# EAGLE design hexa170_heatedbed (EAGLE 6.4)
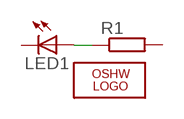
[diagram p0: schematic, sheet 1]

## Parts
LED1  LEDCHIPLED_0805  [CHIPLED_0805]
LOGO1  OSHW_LOGO_10MILX0350-NT  [OSHW_10X350_NOTEXT]
R1  R-EU_M0805  [M0805]

## Nets
N$1: LED1.A R1.1
Unconnected: LED1.C R1.2

## Library data of the parts
LED1 = adafruit_-16081a8:LED: LED OSRAM: - CHIPLED LG R971, LG N971, LY N971, LG Q971, LY Q971, LO R971, LY R971 LH N974, LH R974 LS Q976, LO Q976, LY Q976 LO Q996 - Hyper CHIPLED LW Q18S LB Q993, LB Q99A, LB R99A - SideLED LS A670, LO A670, LY A670, LG A670, LP A670 LB A673, LV A673, LT A673, LW A673 LH A674 LY A675 LS A676, LA A676, LO A676, LY A676, LW A676 LS A679, LY A679, LG A679 - Hyper Micro SIDELED® LS Y876, LA Y876, LO Y876, LY Y876 LT Y87S - SmartLED LW L88C, LW L88S LB L89C, LB L89S, LG L890 LS L89K, LO L89K, LY L89K LS L896, LA L896, LO L896, LY L896 - TOPLED LS T670, LO T670, LY T670, LG T670, LP T670 LSG T670, LSP T670, LSY T670, LOP T670, LYG T670 LG T671, LOG T671, LSG T671 LB T673, LV T673, LT T673, LW T673 LH T674 LS T676, LA T676, LO T676, LY T676, LB T676, LH T676, LSB T676, LW T676 LB T67C, LV T67C, LT T67C, LS T67K, LO T67K, LY T67K, LW E67C LS E67B, LA E67B, LO E67B, LY E67B, LB E67C, LV E67C, LT E67C LW T67C LS T679, LY T679, LG T679 LS T770, LO T770, LY T770, LG T770, LP T770 LB T773, LV T773, LT T773, LW T773 LH T774 LS E675, LA E675, LY E675, LS T675 LS T776, LA T776, LO T776, LY T776, LB T776 LHGB T686 LT T68C, LB T68C - Hyper Mini TOPLED® LB M676 - Mini TOPLED Santana® LG M470 LS M47K, LO M47K, LY M47K Source: http://www.osram.convergy.de/
LOGO1 = ohw-logo:OSHW_LOGO_10MIL
R1 = rcl_mod:R-EU_: RESISTOR, European symbol

## Board
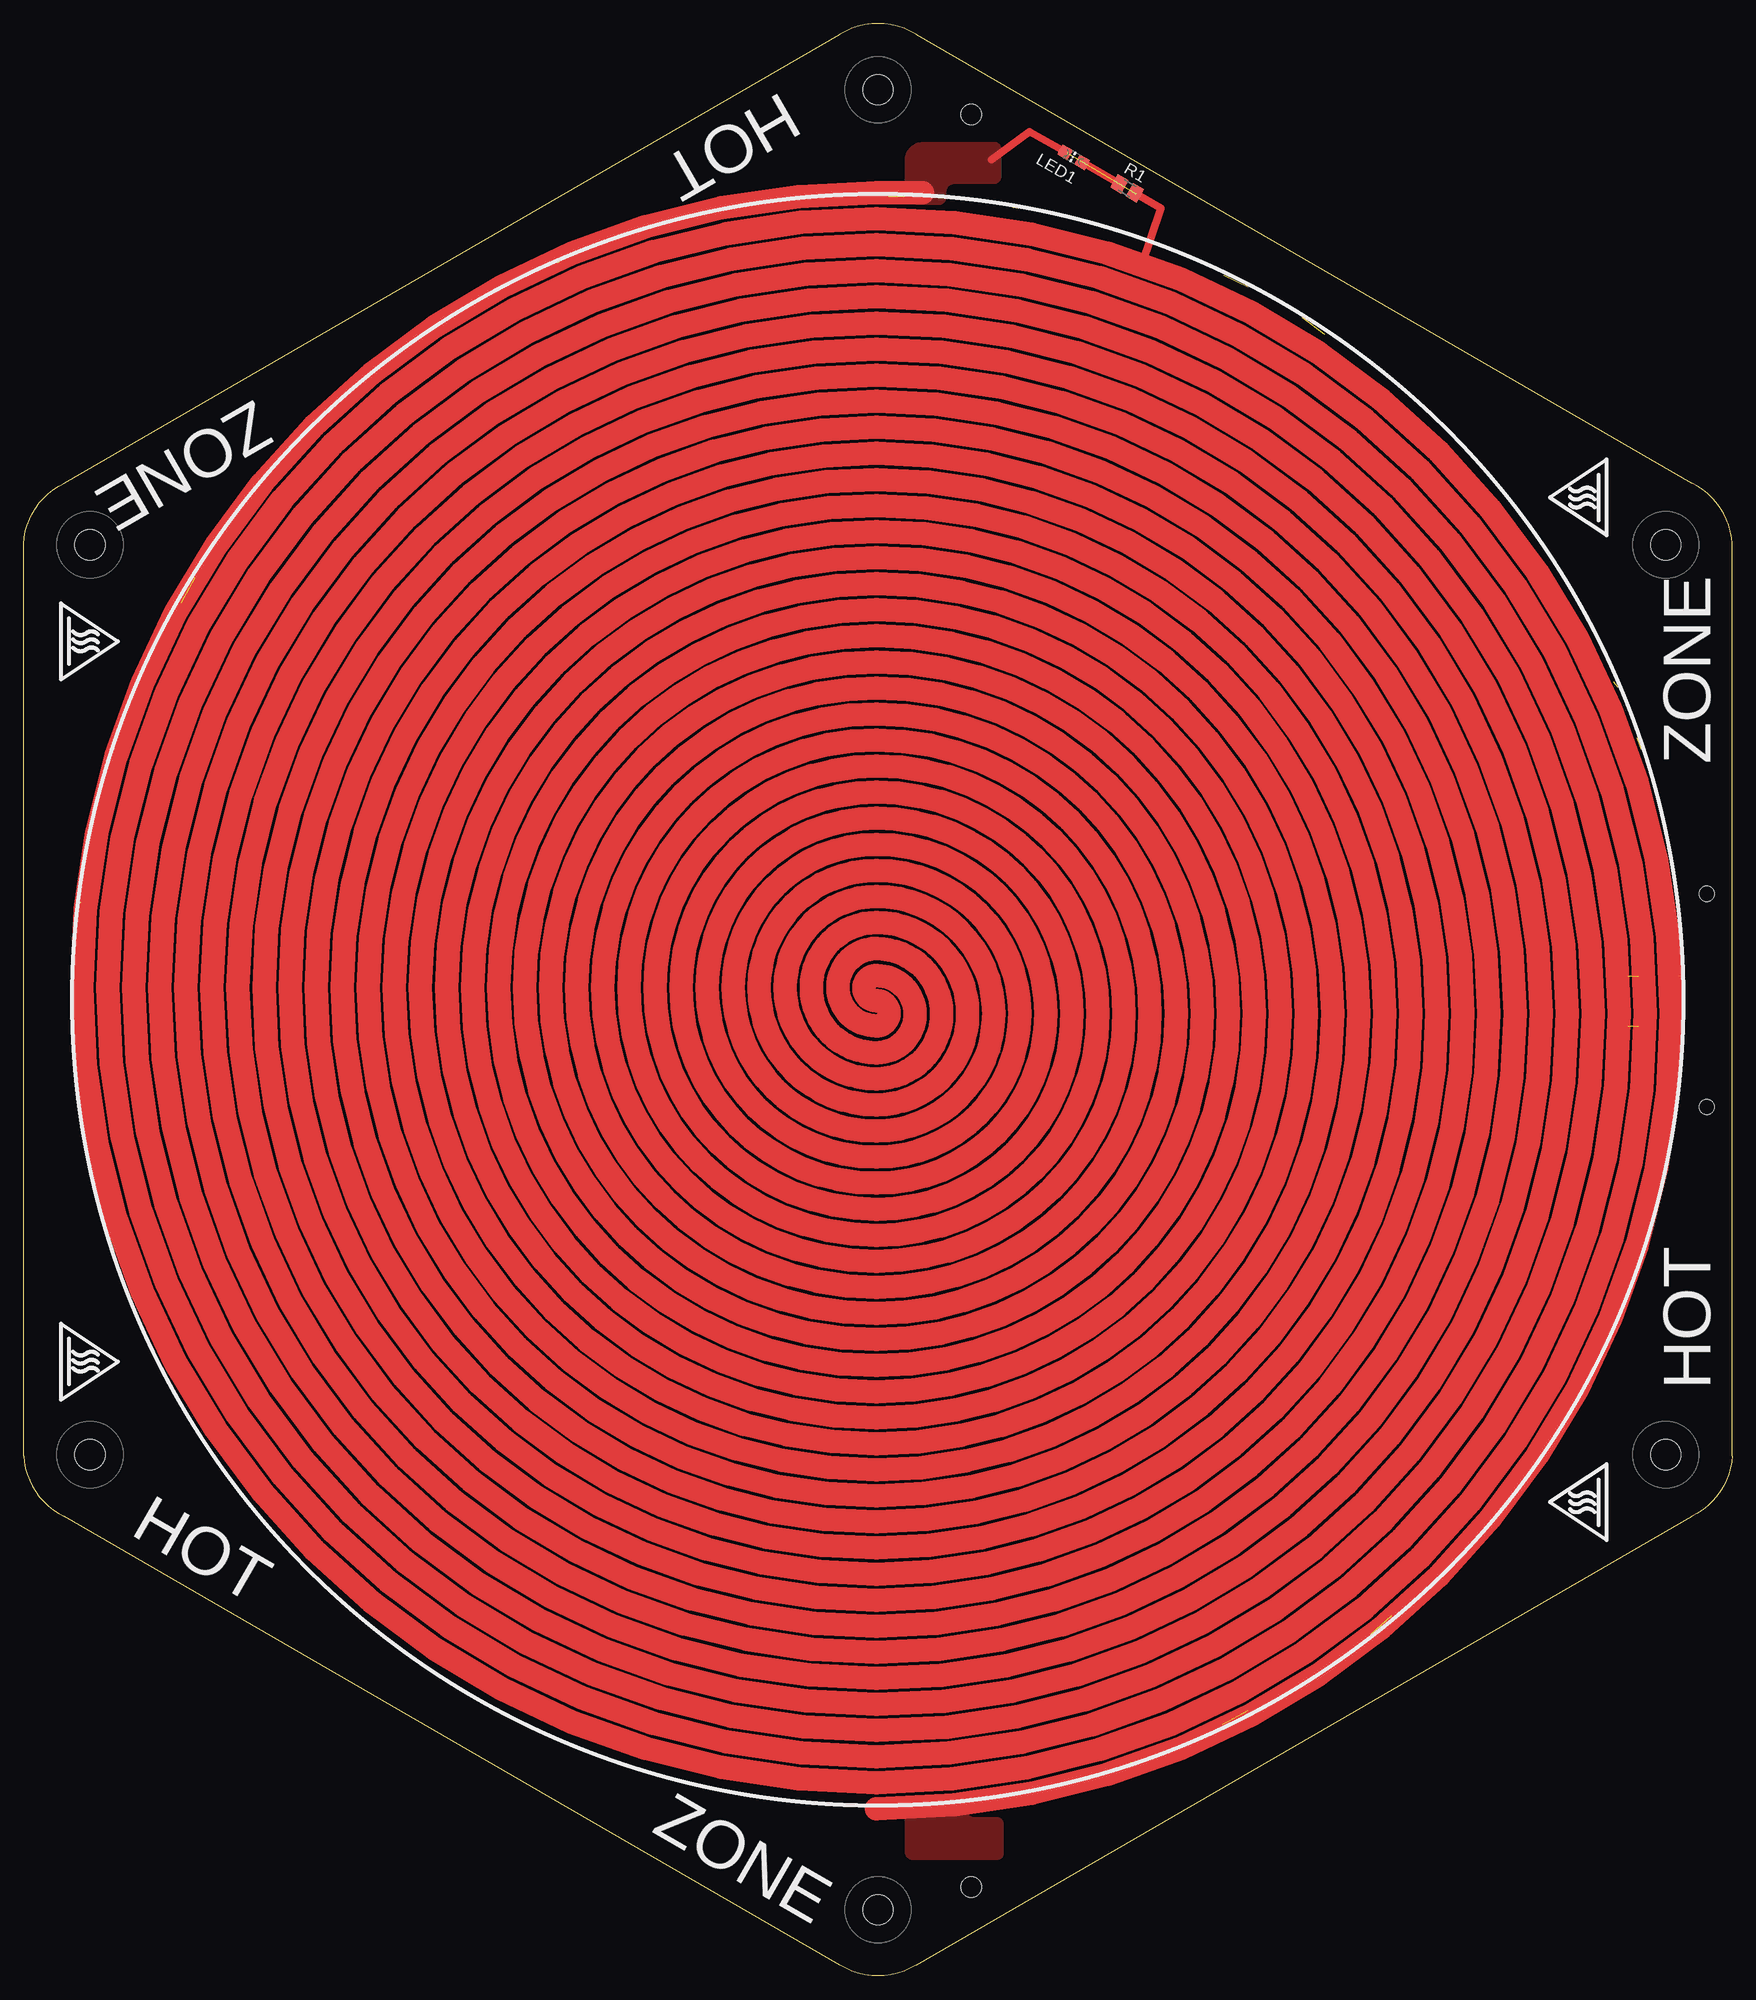
[diagram p1: board, top side]
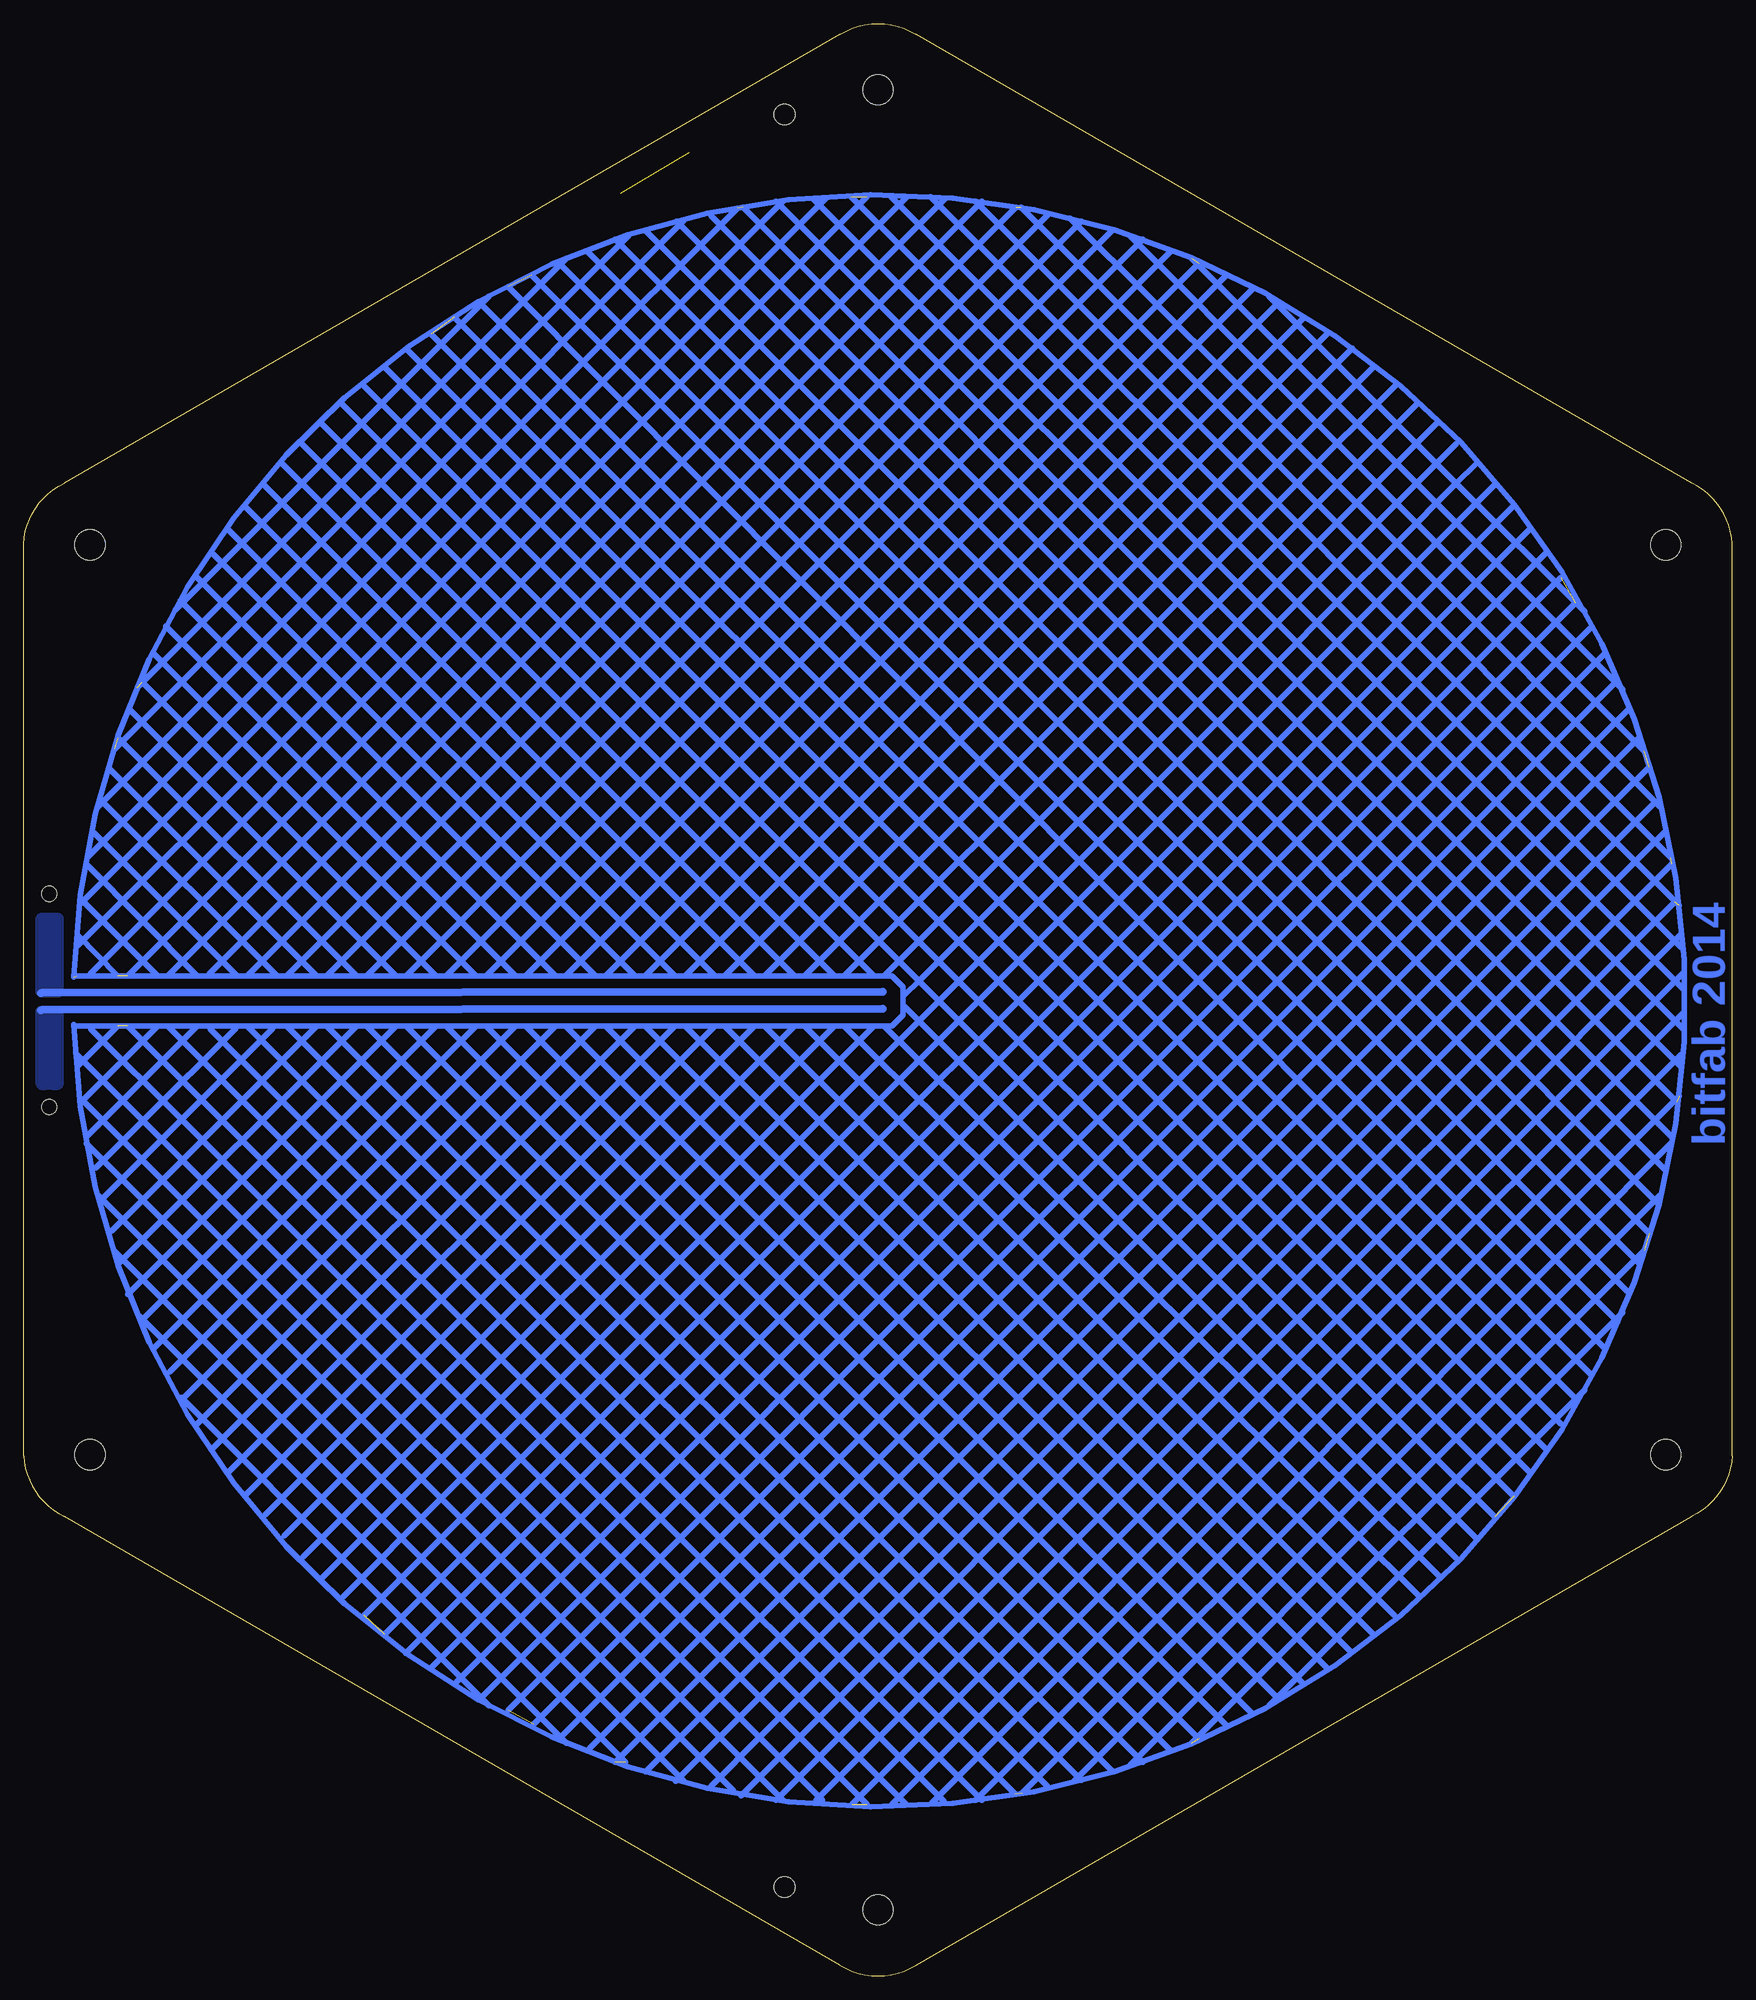
[diagram p2: board, bottom side, seen from below]

Size 180.25 x 205.95 mm. Coordinates in mm from the lower left corner, seen from the top.
Outline: 180.25,54.88 180.25,151.08 arc62 175.97,157.48 94.12,204.85 arc62 86.12,204.85 4.28,157.48 arc62 0,151.08 0,54.88 arc62 4.28,48.48 86.12,1.1 arc62 94.12,1.1 175.97,48.48 arc62 180.25,54.88
Copper layers (1*16): Top 0.035mm / dielectric 1.5mm / Bottom 0.035mm
Design rules "default": minimum track width 10mil, minimum drill 24mil, track to track 8mil, track to pad 8mil, pad to pad 8mil, via to via 8mil, smd to smd 8mil, copper to edge 40mil, drill to drill 8mil, minimum pad ring 10mil, minimum via ring 8mil, stop-mask expansion 4mil, vias tented up to drill 0mil, thermal gap 10mil
Holes 3.2 mm at 90.12,6.98 90.12,198.98 7,54.98 173.25,54.98 7,150.98 173.25,150.98
Holes 1.6 mm at 177.57,91.66 177.57,114.16
Holes 2.2 mm at 99.97,9.38 99.97,196.38

### Footprints (pad centres in the part's own frame; a part is rotated, then mirrored left to right if it is on the bottom)
CHIPLED_0805 = smd 1.2 x 1.2: A 0,-1.05; C 0,1.05
M0805 = smd 1.3 x 1.6: 1 -0.95,0; 2 0.95,0

### Placement (x,y rotation side)
LED1  110.78,191.85 60 top
LOGO1  178.97,61.28 90 top
R1  116.42,188.58 330 top

### Tracks (layer width: path | path; a pad name or v marks a point on that pad's centre or on a via)
CCW  (1 unrouted)
  Top 0.254: 90.35,188.13 89.97,189.24 89.97,188.13
  Top 0.813: 110.05,192.33 106.12,194.58 102.12,191.58 | 117.35,188.03 120,186.5 117.92,180.4
  Top 2.5: 89.97,188.13 arc180 89.97,20.38 arc180 89.97,182.63 arc180 89.97,25.88 arc180 89.97,177.13 arc180 89.97,31.38 arc180 89.97,171.63 arc180 89.97,36.88 arc180 89.97,166.13 arc180 89.97,42.38 arc180 89.97,160.63 arc180 89.97,47.88 arc180 89.97,155.13 arc180 89.97,53.38 arc180 89.97,149.63 arc180 89.97,58.88 arc180 89.97,144.13 arc180 89.97,64.38 arc180 89.97,138.63 arc180 89.97,69.88 arc180 89.97,133.13 arc180 89.97,75.38 arc180 89.97,127.63 arc180 89.97,80.88 arc180 89.97,122.13 arc180 89.97,86.38 arc180 89.97,116.63 arc180 89.97,91.88 arc180 89.97,111.13 arc180 89.97,97.38 arc180 89.97,105.53 arc180 89.97,102.88 arc-180 89.97,100.23 arc-180 89.97,108.38 arc-180 89.97,94.63 arc-180 89.97,113.88 arc-180 89.97,89.13 arc-180 89.97,119.38 arc-180 89.97,83.63 arc-180 89.97,124.88 arc-180 89.97,78.13 arc-180 89.97,130.38 arc-180 89.97,72.63 arc-180 89.97,135.88 arc-180 89.97,67.13 arc-180 89.97,141.38 arc-180 89.97,61.63 arc-180 89.97,146.88 arc-180 89.97,56.13 arc-180 89.97,152.38 arc-180 89.97,50.63 arc-180 89.97,157.88 arc-180 89.97,45.13 arc-180 89.97,163.38 arc-180 89.97,39.63 arc-180 89.97,168.88 arc-180 89.97,34.13 arc-180 89.97,174.38 arc-180 89.97,28.63 arc-180 89.97,179.88 arc-180 89.97,23.13 arc-180 89.97,185.38 arc-180 89.97,17.63 | 90.35,188.13 94.85,188.13
  pour Top: 93.77,12.23 102.67,12.23 arc90 103.38,12.93 103.38,16.03 arc90 102.67,16.73 100.3,16.73 arc-90 99.15,18.23 93.11,18.25 arc90 92.97,17.9 92.97,13.13 arc90
  pour Top: 97.3,187.45 97.33,188.2 arc-90 98.28,189.05 102.42,189.05 arc90 103.12,189.85 103.12,192.75 arc90 102.42,193.45 95.02,193.45 arc90 92.97,191.7 92.97,188.15 arc90 94.56,186.86 96.42,186.86 arc90
N$1
  Top 0.813: R1.1 LED1.A
S$1  (24 unrouted)
  Bottom 0.254: 144.56,163.81 144.59,163.84 144.63,163.79 | 54.47,73.62 54.41,73.67 54.26,73.51 | 138.25,157.51 138.24,157.49 138.28,157.44 | 35.35,54.61 35.37,54.62 35.41,54.57 | 131.95,151.21 131.88,151.14 131.94,151.09 | 41.66,60.91 41.72,60.97 41.77,60.92 | 47.95,67.21 48.06,67.32 48.12,67.27 | 138.38,128.13 138.24,128.28 138.16,128.2 | 121.65,144.71 121.72,144.79 121.58,144.93 | 163.71,90.25 163.63,90.18 163.53,90.28 | 127.97,54.72 128.07,54.62 127.91,54.45 | 32.87,44.5 32.83,44.46 33.02,44.26 | 86.02,54.77 86.17,54.62 85.95,54.41 | 79.64,157.32 79.81,157.49 79.67,157.63 | 86,96.36 86.17,96.53 85.96,96.74 | 79.67,103.02 79.81,102.88 79.65,102.71 | 140.57,42.12 140.78,41.92 140.61,41.75 | 31.35,54.41 31.55,54.62 31.41,54.76 | 31.37,151.32 31.55,151.14 31.39,150.97 | 35.55,58.61 35.37,58.43 35.22,58.57 | 134.27,48.42 134.43,48.27 134.26,48.1 | 140.6,150.96 140.78,151.14 140.58,151.33 | 45.73,157.28 45.52,157.49 45.7,157.66 | 121.67,61.02 121.72,60.97 121.56,60.8 | 134.3,144.66 134.43,144.79 134.23,144.98 | 41.85,64.91 41.72,64.78 41.57,64.92 | 41.87,140.82 41.72,140.98 41.55,140.81 | 58.31,61.05 58.23,60.97 58.42,60.77 | 58.33,144.68 58.23,144.79 58.4,144.96 | 54.45,77.51 54.41,77.48 54.27,77.62 | 54.47,128.22 54.41,128.28 54.25,128.11 | 54.3,60.86 54.41,60.97 54.25,61.13 | 60.75,83.81 60.77,83.83 60.62,83.97 | 60.77,121.92 60.77,121.93 60.6,121.76 | 71.11,77.66 70.92,77.48 70.83,77.57 | 67.05,90.11 67.11,90.18 66.97,90.32 | 66.96,115.73 67.11,115.58 66.95,115.41 | 71.06,90.31 70.92,90.18 70.97,90.13 | 77.42,121.78 77.28,121.93 77.25,121.91 | 73.35,96.41 73.47,96.53 73.32,96.67 | 73.37,109.32 73.47,109.23 73.3,109.06
  Bottom 0.254: 83.7,90.26 83.62,90.18 83.58,90.22 | 83.72,115.48 83.62,115.58 83.61,115.56 | 169.99,92.72 170.07,92.63 | 131.97,54.53 131.88,54.62 131.91,54.65 | 144.57,41.93 144.59,41.92 144.62,41.95 | 29.08,157.43 29.02,157.49 29.05,157.52 | 138.28,48.23 138.24,48.27 138.26,48.3 | 35.38,151.13 35.37,151.14 35.4,151.17 | 41.67,144.83 41.72,144.79 41.74,144.82 | 47.98,138.53 48.06,138.44 48.09,138.47 | 60.58,125.93 60.77,125.74 60.8,125.77 | 64.78,121.73 64.58,121.93 64.61,121.96 | 102.52,25.25 102.67,25.41 102.77,25.32 | 167.56,90.3 167.44,90.18 167.53,90.09
  Bottom 0.6: 174.97,105.38 arc357 174.97,100.38 | 90.53,105.48 148.91,163.86 | 151.06,161.81 140.58,151.33 134.23,144.98 94.73,105.48 | 98.93,105.48 153.06,159.61 | 154.95,157.31 103.13,105.48 | 107.33,105.48 156.75,154.91 | 158.75,152.71 111.53,105.48 | 162.16,147.71 119.93,105.48 | 163.75,145.11 124.13,105.48 | 165.25,142.41 128.33,105.48 | 166.56,139.51 132.53,105.48 | 167.75,136.51 136.73,105.48 | 169.06,133.61 140.93,105.48 | 170.25,130.61 145.13,105.48 | 171.25,127.41 157.2,113.36 | 157.2,113.36 149.33,105.48 | 85.81,104.96 131.94,151.09 138.28,157.44 144.63,163.79 146.75,165.91 | 85.81,104.96 70.97,90.13 54.47,73.62 48.12,67.27 41.77,60.92 35.41,54.57 27.05,46.21 | 85.81,100.76 29.1,44.06 | 30.76,42.01 33.02,44.26 85.96,96.74 89.48,100.23 | 85.81,100.76 64.61,121.96 60.8,125.77 48.09,138.47 41.74,144.82 35.4,151.17 29.05,157.52 27.05,159.51 | 29.1,161.66 85.81,104.96 | 85.81,100.76 131.91,54.65 138.26,48.3 144.62,41.95 146.56,40.01 | 148.7,42.06 90.53,100.23 | 89.48,105.48 31.05,163.91 | 33.16,165.91 77.25,121.91 83.61,115.56 93.68,105.48 | 35.45,167.81 45.7,157.66 58.4,144.96 97.88,105.48 | 37.85,169.71 102.08,105.48 | 40.05,171.71 106.28,105.48 | 42.76,173.21 110.48,105.48 | 45.26,174.91 114.68,105.48 | 47.85,176.51 118.88,105.48 | 50.45,178.11 123.08,105.48 | 53.35,179.41 127.28,105.48 | 150.75,44.21 94.73,100.23 | 152.75,46.41 98.93,100.23 | 154.75,48.61 103.13,100.23 | 156.75,50.81 107.33,100.23 | 158.75,53.01 111.53,100.23 | 160.45,55.51 115.73,100.23 | 162.16,58.01 119.93,100.23 | 163.66,60.71 124.13,100.23 | 164.86,63.71 128.33,100.23 | 166.56,66.21 132.53,100.23 | 167.56,69.41 136.73,100.23 | 169.25,71.91 140.93,100.23
  Bottom 0.6: 170.25,75.11 145.13,100.23 | 170.95,78.61 157.2,92.36 | 157.2,92.36 149.33,100.23 | 131.48,105.48 79.64,157.32 56.26,180.71 | 59.16,182.01 135.68,105.48 | 62.16,183.21 139.88,105.48 | 144.08,105.48 65.36,184.21 | 68.66,185.11 148.28,105.48 | 152.48,105.48 72.06,185.91 | 83.06,187.51 157.2,113.36 | 32.95,40.01 54.25,61.13 70.83,77.57 83.58,90.22 93.68,100.23 | 97.88,100.23 58.42,60.77 35.66,38.01 | 37.85,36.01 102.08,100.23 | 106.28,100.23 40.16,34.11 | 42.76,32.51 110.48,100.23 | 114.68,100.23 45.26,30.81 | 48.16,29.51 118.88,100.23 | 123.08,100.23 50.66,27.71 | 53.35,26.41 127.28,100.23 | 131.48,100.23 86.02,54.77 56.26,25.01 | 59.25,23.81 135.68,100.23 | 139.88,100.23 62.16,22.51 | 65.36,21.51 144.08,100.23 | 148.28,100.23 68.66,20.61 | 72.25,20.01 152.48,100.23 | 83.16,18.41 157.2,92.36 | 174.63,100.23 170.33,100.23 | 170.33,100.23 166.13,100.23 | 166.13,100.23 161.93,100.23 | 161.93,100.23 152.48,100.23 | 152.48,100.23 149.33,100.23 | 149.33,100.23 148.28,100.23 | 148.28,100.23 145.13,100.23 | 145.13,100.23 144.08,100.23 | 144.08,100.23 140.93,100.23 | 140.93,100.23 139.88,100.23 | 139.88,100.23 136.73,100.23 | 136.73,100.23 135.68,100.23 | 135.68,100.23 132.53,100.23 | 132.53,100.23 131.48,100.23 | 131.48,100.23 128.33,100.23 | 128.33,100.23 127.28,100.23 | 127.28,100.23 124.13,100.23 | 124.13,100.23 123.08,100.23 | 123.08,100.23 119.93,100.23 | 119.93,100.23 118.88,100.23 | 118.88,100.23 115.73,100.23 | 115.73,100.23 114.68,100.23 | 114.68,100.23 111.53,100.23 | 111.53,100.23 110.48,100.23 | 110.48,100.23 107.33,100.23 | 107.33,100.23 106.28,100.23 | 106.28,100.23 103.13,100.23 | 103.13,100.23 102.08,100.23 | 102.08,100.23 98.93,100.23
  Bottom 0.6: 98.93,100.23 97.88,100.23 | 97.88,100.23 94.73,100.23 | 94.73,100.23 93.68,100.23 | 93.68,100.23 90.53,100.23 | 90.53,100.23 89.48,100.23 | 89.48,105.48 90.53,105.48 | 90.53,105.48 93.68,105.48 | 93.68,105.48 94.73,105.48 | 94.73,105.48 97.88,105.48 | 97.88,105.48 98.93,105.48 | 98.93,105.48 102.08,105.48 | 102.08,105.48 103.13,105.48 | 103.13,105.48 106.28,105.48 | 106.28,105.48 107.33,105.48 | 107.33,105.48 110.48,105.48 | 110.48,105.48 111.53,105.48 | 111.53,105.48 114.68,105.48 | 114.68,105.48 118.88,105.48 | 118.88,105.48 119.93,105.48 | 119.93,105.48 123.08,105.48 | 123.08,105.48 124.13,105.48 | 124.13,105.48 127.28,105.48 | 127.28,105.48 128.33,105.48 | 128.33,105.48 131.48,105.48 | 131.48,105.48 132.53,105.48 | 132.53,105.48 135.68,105.48 | 135.68,105.48 136.73,105.48 | 136.73,105.48 139.88,105.48 | 139.88,105.48 140.93,105.48 | 140.93,105.48 144.08,105.48 | 144.08,105.48 145.13,105.48 | 145.13,105.48 148.28,105.48 | 148.28,105.48 149.33,105.48 | 149.33,105.48 152.48,105.48 | 152.48,105.48 153.53,105.48 | 153.53,105.48 157.73,105.48 | 157.73,105.48 161.93,105.48 | 161.93,105.48 166.13,105.48 | 166.13,105.48 170.33,105.48 | 170.33,105.48 174.63,105.48 | 153.53,105.48 172.16,124.11 | 172.25,81.71 163.71,90.25 154,99.96 | 172.66,85.21 167.56,90.3 157.91,99.96 | 157.2,113.36 165,105.56 | 157.2,92.36 165,100.16 | 75.66,19.21 156.66,100.21 | 79.16,18.51 121.67,61.02 160.56,99.91 | 87.16,18.11 169.25,100.21 | 91.25,18.11 127.97,54.72 163.53,90.28 173.16,99.91 | 95.95,18.51 102.77,25.32 131.97,54.53 167.53,90.09 169.81,92.36 | 169.81,92.36 170.07,92.63 174.75,97.31 | 75.56,186.61 156.66,105.51 | 79.16,187.21 121.65,144.71 138.16,128.2 160.66,105.71
  Bottom 0.6: 169.25,105.51 87.06,187.71 | 91.25,187.71 134.3,144.66 173.25,105.71 | 174.56,108.71 131.95,151.21 95.56,187.61 | 173.56,118.01 140.6,150.96 104.95,186.51 | 110.56,185.21 138.25,157.51 172.45,123.31 | 170.66,129.41 116.45,183.61 | 168.25,135.91 122.95,181.21 | 115.75,105.51 138.38,128.13 160.25,150.01 | 100.16,18.51 174,92.36 | 174,92.36 174.16,92.51 | 105.36,19.51 134.27,48.42 173.66,87.81 | 110.56,20.51 138.28,48.23 172.45,82.41 | 116.75,22.51 170.75,76.51 | 122.95,24.51 140.57,42.12 168.06,69.61 | 131.16,28.51 144.57,41.93 163.66,61.01 | 144.35,167.71 121.58,144.93 79.67,103.02 73.32,96.67 66.97,90.32 60.62,83.97 54.27,77.62 41.57,64.92 35.22,58.57 31.41,54.76 25.06,48.41 | 8.75,78.31 114.66,184.11 | 117.86,183.21 60.58,125.93 9.75,75.11 | 123.75,180.71 64.78,121.73 12.06,69.01 | 129.16,178.21 66.96,115.73 14.86,63.41 | 13.56,66.31 126.66,179.41 | 11.06,72.21 60.77,121.92 120.75,181.91 | 16.56,60.91 77.42,121.78 132.25,176.61 | 19.56,55.51 73.37,109.32 137.25,173.21 | 134.85,175.01 18.06,58.21 | 139.85,171.61 83.72,115.48 21.36,53.11 | 23.06,50.61 142.16,169.71 | 111.36,185.11 54.47,128.22 7.86,81.51 | 7.06,85.01 79.67,157.63 107.75,185.71 | 96.95,187.51 47.98,138.53 5.45,96.01 | 48.85,177.21 29.08,157.43 15.56,143.91 | 11.56,135.71 57.05,181.21 | 63.55,183.61 31.37,151.32 9.25,129.21 | 7.56,123.31 35.38,151.13 69.86,185.41 | 75.06,186.61 45.73,157.28 6.45,118.01 | 5.56,112.91 79.86,187.21 | 84.56,187.71 41.67,144.83 5.36,108.51 | 92.95,187.71 5.06,99.81 | 5.86,92.21 58.33,144.68 100.86,187.21 | 5.06,104.01 41.87,140.82 88.75,187.71 | 104.36,186.61 6.36,88.51 | 5.36,97.21 41.66,60.91 84.45,18.21
  Bottom 0.6: 5.06,101.71 41.85,64.91 88.66,18.11 | 92.86,18.11 5.06,105.91 | 5.36,109.91 47.95,67.21 54.3,60.86 96.66,18.51 | 100.86,18.51 58.31,61.05 6.06,113.31 | 6.36,117.31 104.56,19.01 | 107.75,20.01 102.52,25.25 54.26,73.51 7.06,120.71 | 5.56,92.81 79.86,18.51 | 74.86,19.31 35.55,58.61 6.36,87.91 | 7.56,82.41 35.35,54.61 69.45,20.51 | 85.81,104.96 87.31,103.46 | 87.31,102.26 85.81,100.76 | 89.48,100.23 88.62,100.23 87.47,101.38 87.47,104.33 88.62,105.48 89.48,105.48 | 9.25,76.51 31.35,54.41 63.55,22.21 | 57.05,24.51 11.56,70.01 | 15.56,61.81 32.87,44.5 48.85,28.51 | 8.06,123.91 54.45,77.51 111.45,20.51 | 114.66,21.51 8.75,127.51 | 9.75,130.71 85.95,54.41 117.86,22.51 | 120.56,24.01 60.75,83.81 10.86,133.71 | 12.56,136.21 71.11,77.66 123.75,25.01 | 25.06,157.31 31.39,150.97 41.55,140.81 54.25,128.11 60.6,121.76 66.95,115.41 73.3,109.06 79.65,102.71 86,96.36 121.56,60.8 127.91,54.45 134.26,48.1 140.61,41.75 144.35,38.01 | 142.16,36.01 23.06,155.11 | 21.36,152.61 83.7,90.26 139.95,34.01 | 137.25,32.51 73.35,96.41 19.56,150.21 | 131.85,29.51 71.06,90.31 16.56,144.81 | 18.06,147.51 134.56,31.01 | 126.45,26.51 13.56,139.41 | 14.95,142.21 67.05,90.11 129.16,28.01 | 164.25,144.11 144.56,163.81 131.16,177.21 | 169.81,92.36 161.93,100.23 | 174,92.36 166.13,100.23 | 174.61,95.96 170.33,100.23 | 172.86,120.61 157.73,105.48 | 173.66,117.31 161.93,105.48 | 174.25,113.61 166.13,105.48 | 174.56,109.81 170.33,105.48 | 173.61,88.56 169.81,92.36
S$2
  Bottom 0.6: 100.16,187.21 174.25,113.11
S$3
  Bottom 0.85: 89.62,102.01 178.41,101.88
  pour Bottom: 176.06,102.28 178.36,102.28 arc-90 178.98,101.78 178.95,94.21 arc-90 178.33,93.46 176.68,93.46 arc-90 176.06,94.33
S$4
  Bottom 0.85: 89.62,103.81 178.41,103.68
  pour Bottom: 176.43,103.28 178.36,103.28 arc90 178.98,103.78 178.95,111.61 arc90 178.33,112.11 176.68,112.11 arc90 176.06,111.61 176.06,103.78 arc90

### Text on the board
Bottom: bitfab 2014
tPlace: HOT | ZONE | ZONE | HOT | HOT | ZONE
tStop: - | - | -
bStop: thermistor | DC12V | heater